# Altium schematic sheet Directional Coupler.SchDoc
size 635 x 241 mm
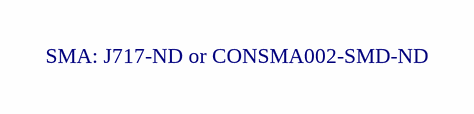
[diagram p0: Directional Coupler.SchDoc]

## Notes on the sheet
- SMA: J717-ND or CONSMA002-SMD-ND